# EAGLE design Hauptplatine (EAGLE 5.12)
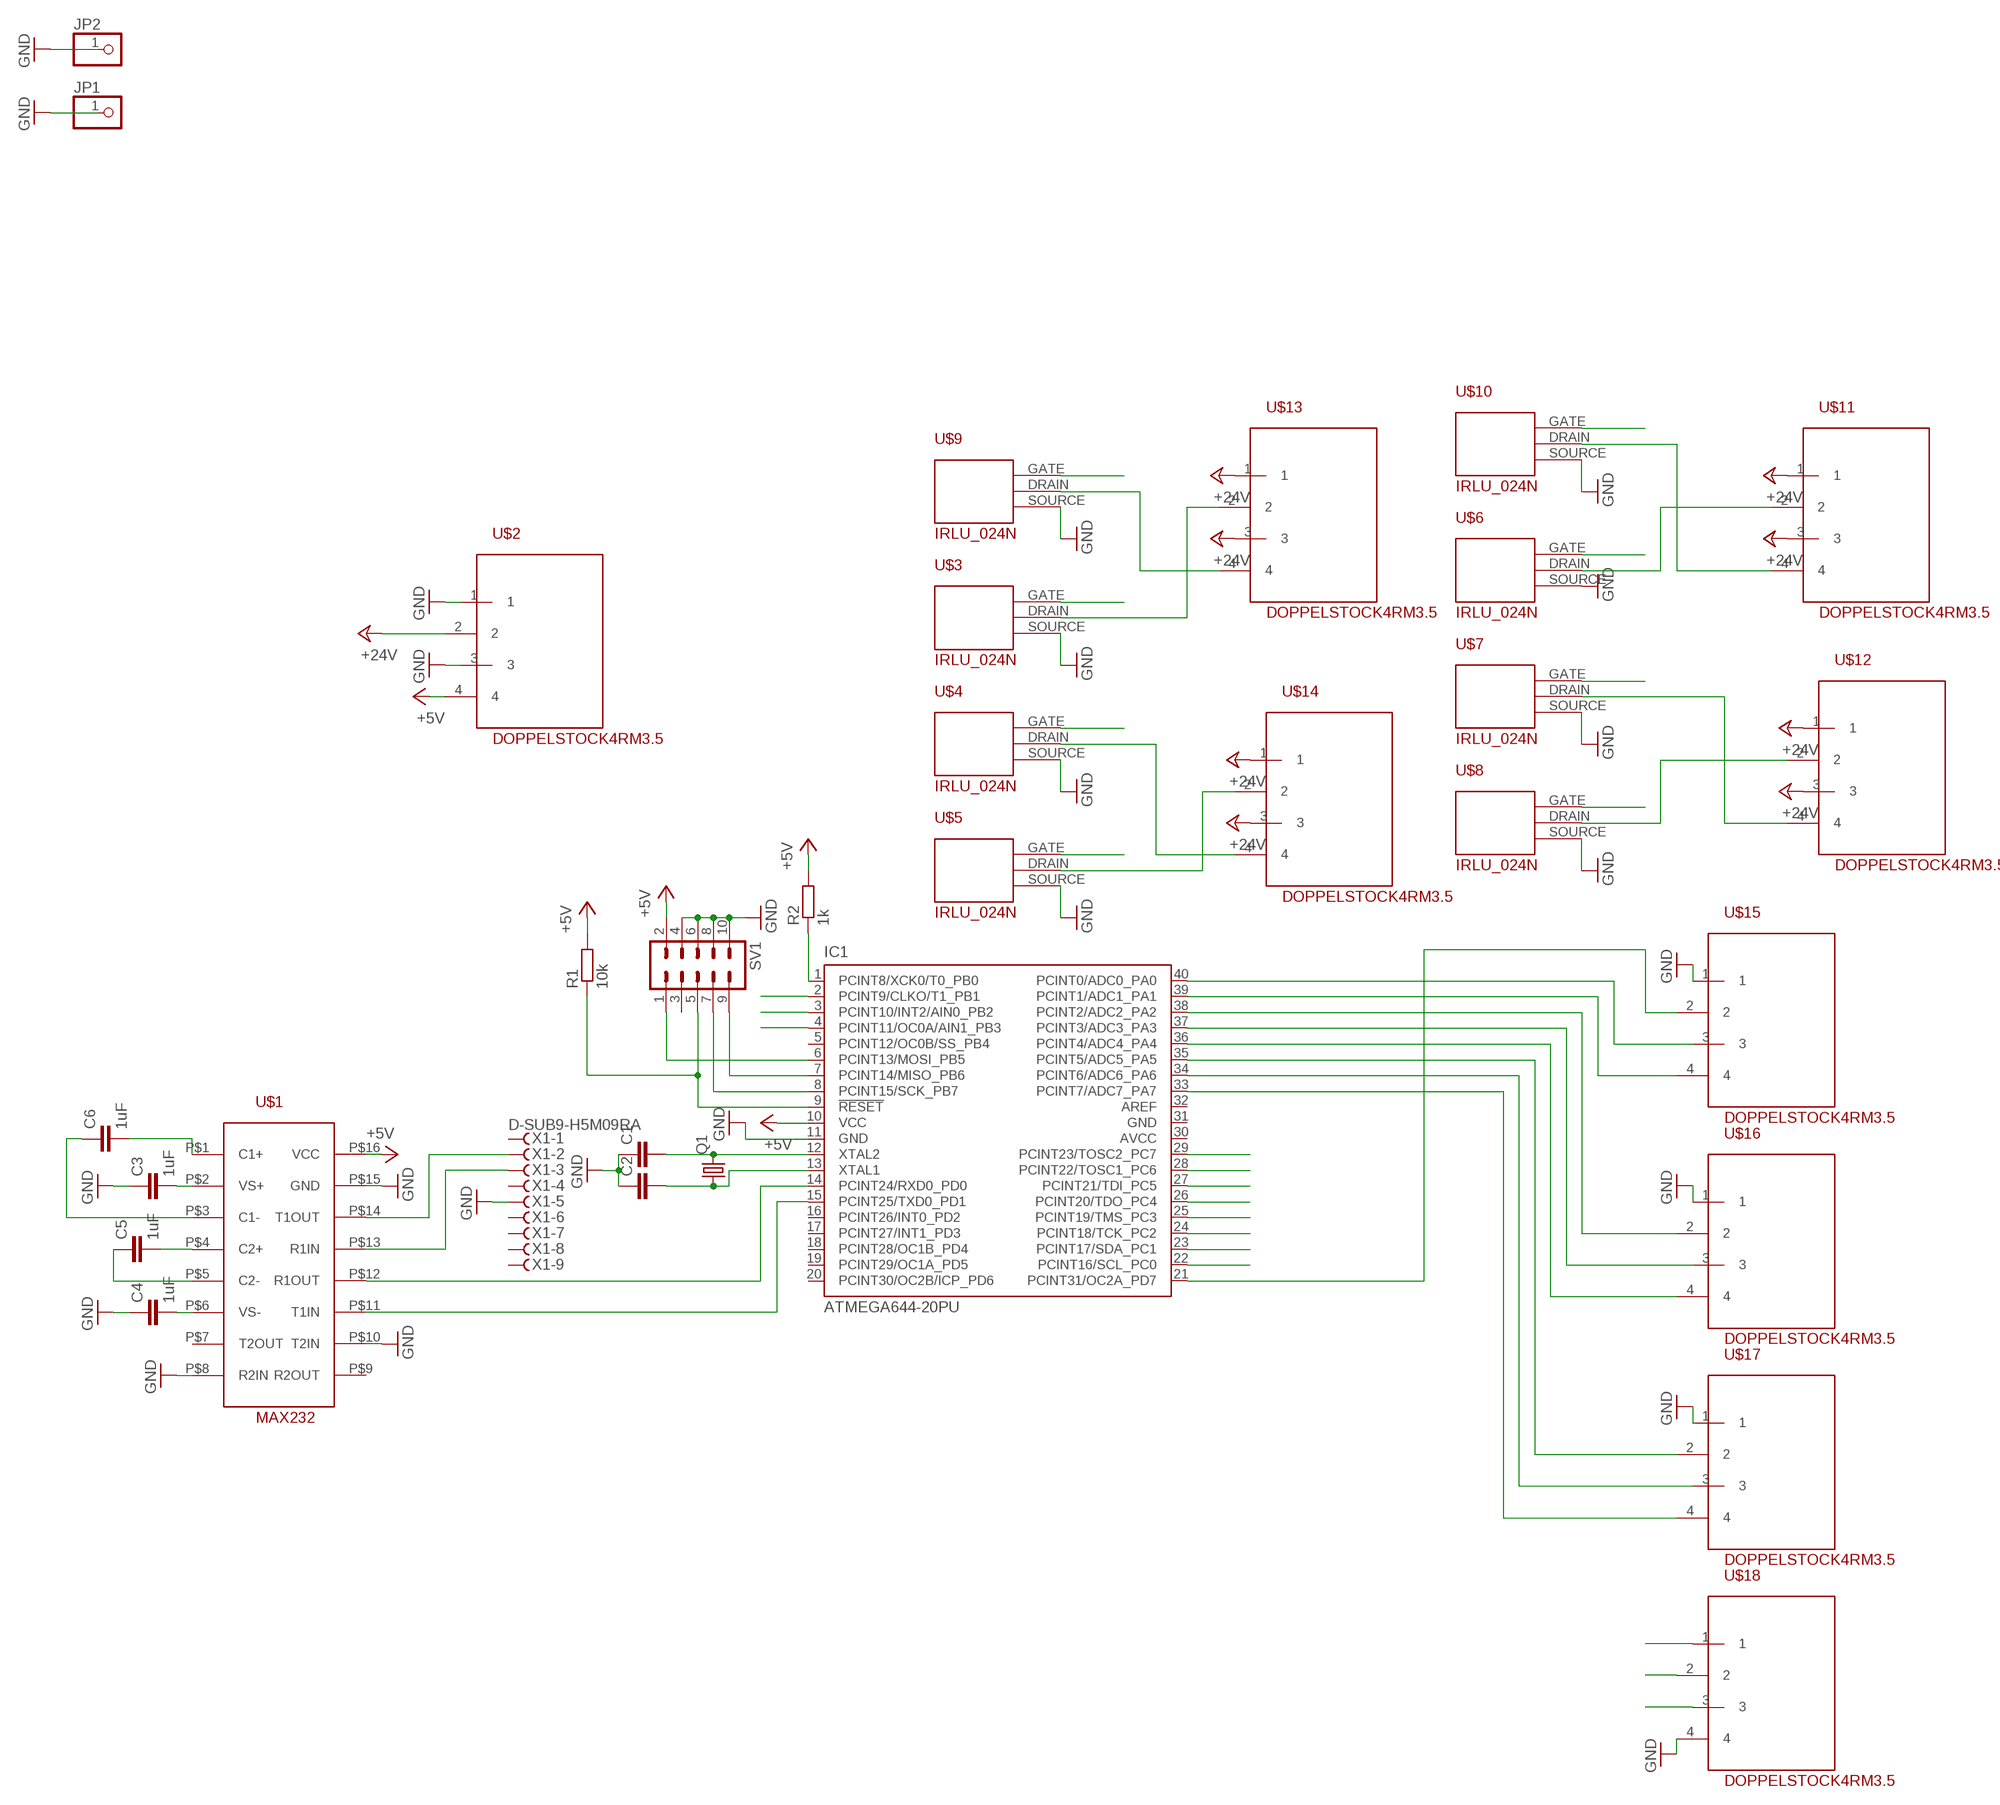
[diagram p0: schematic, sheet 1, part 1 of 2]
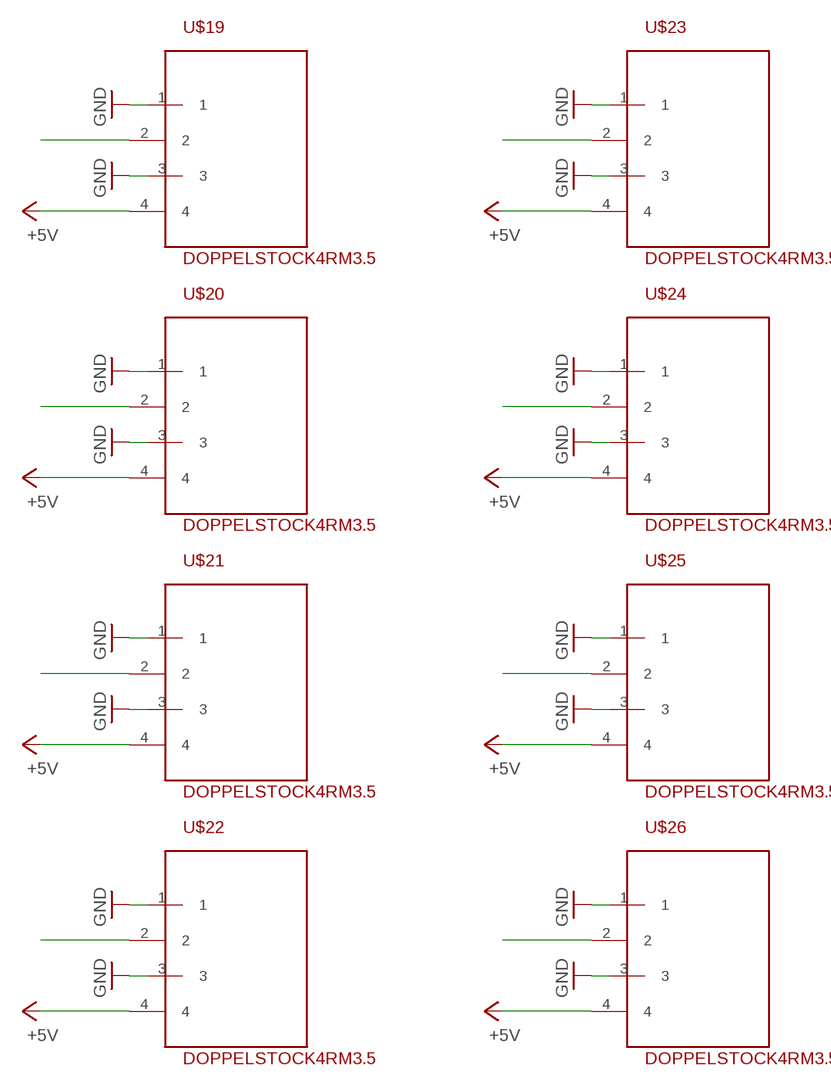
[diagram p1: schematic, sheet 1, part 2 of 2]

## Parts
C1  C-EUC0805  [C0805]
C2  C-EUC0805  [C0805]
C3  1uF  C-EUC1206  [C1206]
C4  1uF  C-EUC1206  [C1206]
C5  1uF  C-EUC1206  [C1206]
C6  1uF  C-EUC1206  [C1206]
IC1  ATMEGA644-20PU  [DIL40]
JP1  PINHD-1X1  [1X01]
JP2  PINHD-1X1  [1X01]
Q1  CRYSTALHC18U-V  [HC18U-V]
R1  10k  R-EU_R0805  [R0805]
R2  1k  R-EU_R1206  [R1206]
SV1  ML10  [ML10]
U$1  MAX232  [MAX232-DIL]
U$2  DOPPELSTOCK4RM3.5  [DOPPELSTOCK4RM3.5]
U$3  IRLU_024N  [IRLU_024N]
U$4  IRLU_024N  [IRLU_024N]
U$5  IRLU_024N  [IRLU_024N]
U$6  IRLU_024N  [IRLU_024N]
U$7  IRLU_024N  [IRLU_024N]
U$8  IRLU_024N  [IRLU_024N]
U$9  IRLU_024N  [IRLU_024N]
U$10  IRLU_024N  [IRLU_024N]
U$11  DOPPELSTOCK4RM3.5  [DOPPELSTOCK4RM3.5]
U$12  DOPPELSTOCK4RM3.5  [DOPPELSTOCK4RM3.5]
U$13  DOPPELSTOCK4RM3.5  [DOPPELSTOCK4RM3.5]
U$14  DOPPELSTOCK4RM3.5  [DOPPELSTOCK4RM3.5]
U$15  DOPPELSTOCK4RM3.5  [DOPPELSTOCK4RM3.5]
U$16  DOPPELSTOCK4RM3.5  [DOPPELSTOCK4RM3.5]
U$17  DOPPELSTOCK4RM3.5  [DOPPELSTOCK4RM3.5]
U$18  DOPPELSTOCK4RM3.5  [DOPPELSTOCK4RM3.5]
U$19  DOPPELSTOCK4RM3.5  [DOPPELSTOCK4RM3.5]
U$20  DOPPELSTOCK4RM3.5  [DOPPELSTOCK4RM3.5]
U$21  DOPPELSTOCK4RM3.5  [DOPPELSTOCK4RM3.5]
U$22  DOPPELSTOCK4RM3.5  [DOPPELSTOCK4RM3.5]
U$23  DOPPELSTOCK4RM3.5  [DOPPELSTOCK4RM3.5]
U$24  DOPPELSTOCK4RM3.5  [DOPPELSTOCK4RM3.5]
U$25  DOPPELSTOCK4RM3.5  [DOPPELSTOCK4RM3.5]
U$26  DOPPELSTOCK4RM3.5  [DOPPELSTOCK4RM3.5]
X1  D-SUB9-H5M09RA  [H5M09RA]

## Nets
+5V: IC1.10(VCC) R1.2 R2.2 SV1.2 U$1.P$16(VCC) U$2.4 U$19.4 U$20.4 U$21.4 U$22.4 U$23.4 U$24.4 U$25.4 U$26.4
+24V: U$2.2 U$11.1 U$11.3 U$12.1 U$12.3 U$13.1 U$13.3 U$14.1 U$14.3
GND: C1.1 C2.1 C3.1 C4.1 IC1.11(GND) JP1.1 JP2.1 SV1.4 SV1.6 SV1.8 SV1.10 U$1.P$8(R2IN) U$1.P$10(T2IN) U$1.P$15(GND) U$2.1 U$2.3 U$3.SOURCE U$4.SOURCE U$5.SOURCE U$6.SOURCE U$7.SOURCE U$8.SOURCE U$9.SOURCE U$10.SOURCE U$15.1 U$16.1 U$17.1 U$18.4 U$19.1 U$19.3 U$20.1 U$20.3 U$21.1 U$21.3 U$22.1 U$22.3 U$23.1 U$23.3 U$24.1 U$24.3 U$25.1 U$25.3 U$26.1 U$26.3 X1.5
N$1: C1.2 IC1.12(XTAL2) Q1.2
N$2: C2.2 IC1.13(XTAL1) Q1.1
N$3: C3.2 U$1.P$2(VS+)
N$4: C4.2 U$1.P$6(VS-)
N$5: C6.2 U$1.P$1(C1+)
N$6: C6.1 U$1.P$3(C1-)
N$7: C5.2 U$1.P$4(C2+)
N$8: C5.1 U$1.P$5(C2-)
N$9: IC1.15(PCINT25/TXD0_PD1) U$1.P$11(T1IN)
N$10: IC1.14(PCINT24/RXD0_PD0) U$1.P$12(R1OUT)
N$11: U$1.P$14(T1OUT) X1.2
N$12: U$1.P$13(R1IN) X1.3
N$13: IC1.6(PCINT13/MOSI_PB5) SV1.1
N$14: IC1.7(PCINT14/MISO_PB6) SV1.9
N$15: IC1.8(PCINT15/SCK_PB7) SV1.7
N$16: IC1.9(!RESET) R1.1 SV1.5
N$17: U$6.DRAIN U$11.2
N$18: U$8.DRAIN U$12.2
N$20: IC1.40(PCINT0/ADC0_PA0) U$15.3
N$21: IC1.39(PCINT1/ADC1_PA1) U$15.4
N$22: IC1.38(PCINT2/ADC2_PA2) U$16.2
N$23: IC1.37(PCINT3/ADC3_PA3) U$16.3
N$24: IC1.36(PCINT4/ADC4_PA4) U$16.4
N$25: IC1.35(PCINT5/ADC5_PA5) U$17.2
N$26: IC1.34(PCINT6/ADC6_PA6) U$17.3
N$27: IC1.33(PCINT7/ADC7_PA7) U$17.4
N$29: IC1.21(PCINT31/OC2A_PD7) U$15.2
ONEWIRE: IC1.1(PCINT8/XCK0/T0_PB0) R2.1 U$19.2 U$20.2 U$21.2 U$22.2 U$23.2 U$24.2 U$25.2 U$26.2
PB1: IC1.2(PCINT9/CLKO/T1_PB1) U$18.1
PB2: IC1.3(PCINT10/INT2/AIN0_PB2) U$18.2
PB3: IC1.4(PCINT11/OC0A/AIN1_PB3) U$18.3
S0: U$9.DRAIN U$13.4
S1: U$3.DRAIN U$13.2
S2: U$4.DRAIN U$14.4
S3: U$5.DRAIN U$14.2
S4: U$10.DRAIN U$11.4
S6: U$7.DRAIN U$12.4
SA0: IC1.22(PCINT16/SCL_PC0) U$9.GATE
SA1: IC1.23(PCINT17/SDA_PC1) U$3.GATE
SA2: IC1.24(PCINT18/TCK_PC2) U$4.GATE
SA3: IC1.25(PCINT19/TMS_PC3) U$5.GATE
SA4: IC1.26(PCINT20/TDO_PC4) U$10.GATE
SA5: IC1.27(PCINT21/TDI_PC5) U$6.GATE
SA6: IC1.28(PCINT22/TOSC1_PC6) U$7.GATE
SA7: IC1.29(PCINT23/TOSC2_PC7) U$8.GATE
Unconnected: IC1.5(PCINT12/OC0B/SS_PB4) IC1.16(PCINT26/INT0_PD2) IC1.17(PCINT27/INT1_PD3) IC1.18(PCINT28/OC1B_PD4) IC1.19(PCINT29/OC1A_PD5) IC1.20(PCINT30/OC2B/ICP_PD6) IC1.32(AREF) SV1.3 U$1.P$7(T2OUT) U$1.P$9(R2OUT) X1.1 X1.4 X1.6 X1.7 X1.8 X1.9

## Power pins joined to a net without a drawn wire
AVCC: IC1.30(AVCC)
GND: IC1.31(GND)

## Library data of the parts
C1-C6 = rcl:C-EU: CAPACITOR, European symbol
IC1 = atmel:ATMEGA644-*PU: 8-bit Microcontroller with 64K Bytes In-System Programmable Flash Auto generated by make-symbol-device-package-bsdl.ulp Rev. 34 Source: http://www.atmel.com/dyn/resources/prod_documents/doc2593.pdf; MPN: ATMEGA644-20PU; OC_FARNELL: 1288340; OC_NEWARK: 23M5060
JP1 JP2 = pinhead:PINHD-1X1: PIN HEADER
Q1 = crystal:CRYSTAL: CRYSTAL; OC_FARNELL: unknown; OC_NEWARK: unknown
R1 R2 = rcl:R-EU_: RESISTOR, European symbol
SV1 = con-harting-ml:ML10: HARTING; OC_FARNELL: unknown; OC_NEWARK: unknown
U$1 = max232:MAX232
U$2 U$11-U$26 = anschlussklemmen:DOPPELSTOCK4
U$3-U$10 = irlu024n:IRLU_024N
X1 = con-thomas-betts:D-SUB9-: D-Subminiatur Connector Source: Electronioc Interconnects European Edition 1998; OC_FARNELL: unknown; OC_NEWARK: unknown

## Board
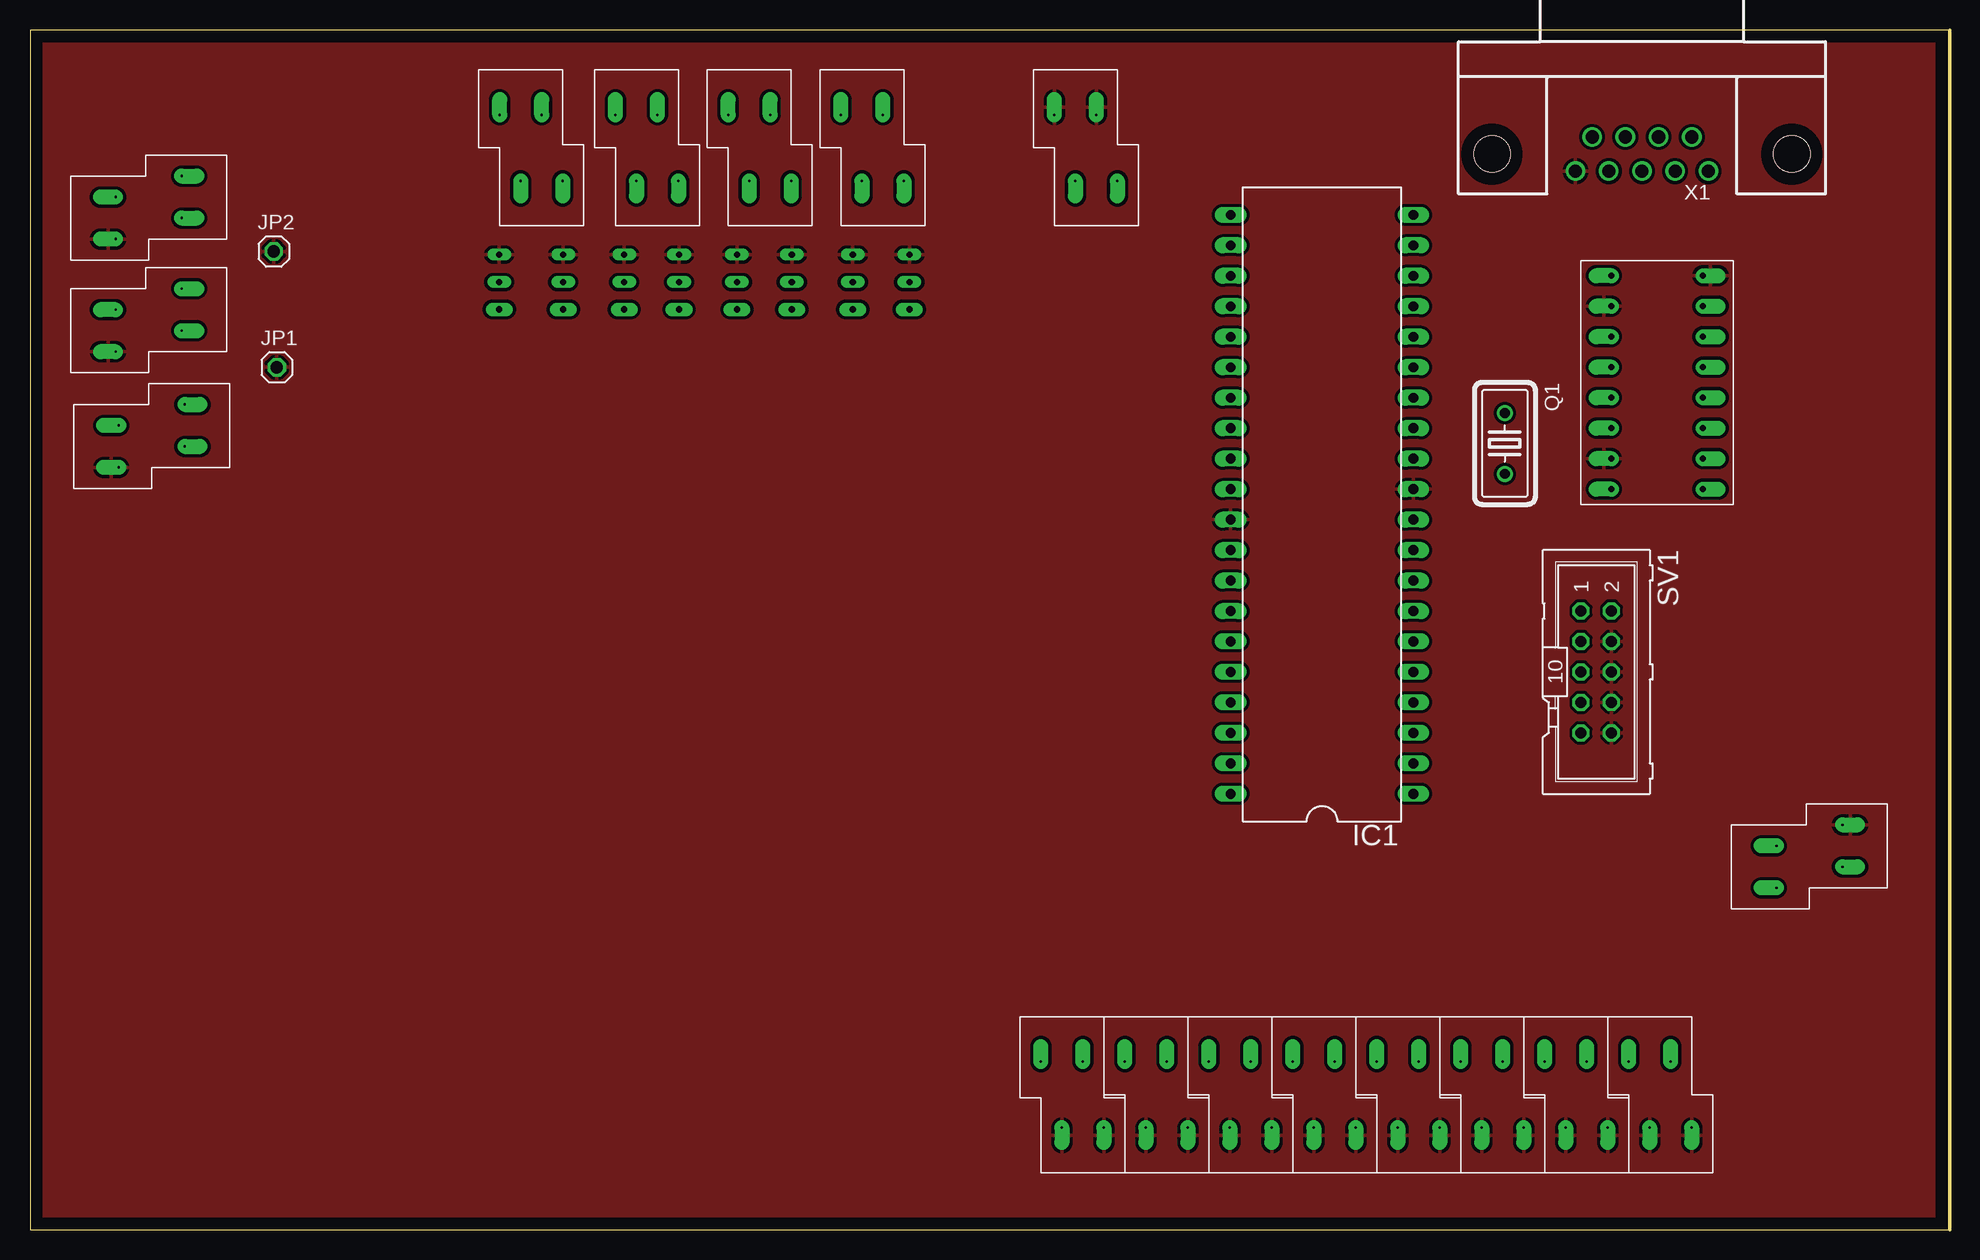
[diagram p2: board, top side]
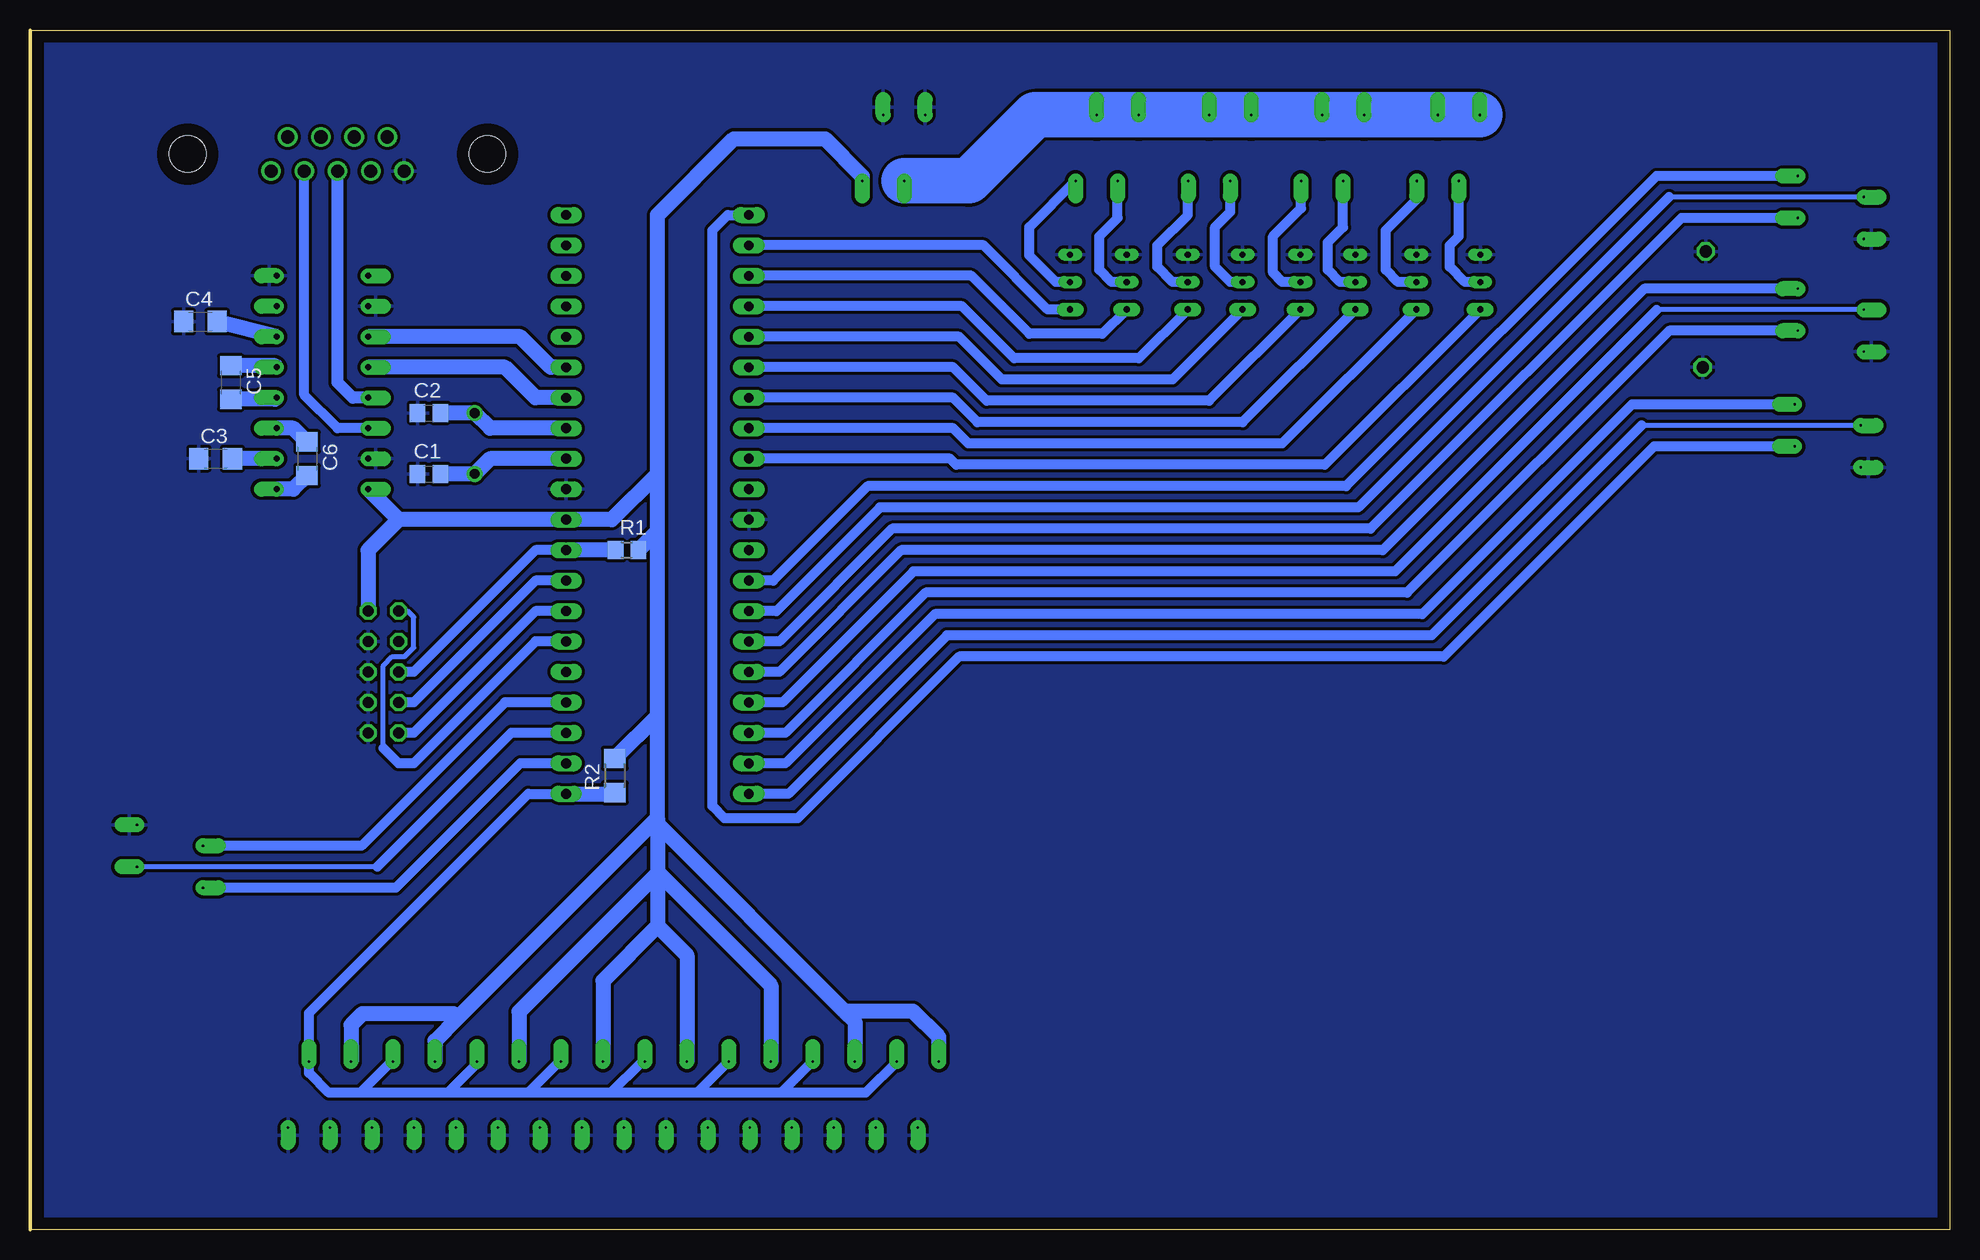
[diagram p3: board, bottom side, seen from below]

Size 160 x 100 mm. Coordinates in mm from the lower left corner, seen from the top.
Outline: 0,0 160,0 160,100 0,100 0,0
Copper layers (1*16): Top 0.035mm / dielectric 1.5mm / Bottom 0.035mm
Design rules "default *": minimum track width 10mil, minimum drill 1mil, track to track 10mil, track to pad 12mil, pad to pad 12mil, via to via 12mil, smd to smd 12mil, copper to edge 40mil, drill to drill 8mil, minimum pad ring 10mil, minimum via ring 8mil, stop-mask expansion 4mil, vias tented up to drill 0mil, thermal gap 10mil

### Footprints (pad centres in the part's own frame; a part is rotated, then mirrored left to right if it is on the bottom)
C0805 = smd 1.3 x 1.5: 1 -0.95,0; 2 0.95,0
C1206 = smd 1.6 x 1.8: 1 -1.4,0; 2 1.4,0
DIL40 = drill 0.813 long: 1 -24.13,-7.62; 2 -21.59,-7.62; 3 -19.05,-7.62; 4 -16.51,-7.62; 5 -13.97,-7.62; 6 -11.43,-7.62; 7 -8.89,-7.62; 8 -6.35,-7.62; 9 -3.81,-7.62; 10 -1.27,-7.62; 11 1.27,-7.62; 12 3.81,-7.62; 13 6.35,-7.62; 14 8.89,-7.62; 15 11.43,-7.62; 16 13.97,-7.62; 17 16.51,-7.62; 18 19.05,-7.62; 19 21.59,-7.62; 20 24.13,-7.62; 21 24.13,7.62; 22 21.59,7.62; 23 19.05,7.62; 24 16.51,7.62; 25 13.97,7.62; 26 11.43,7.62; 27 8.89,7.62; 28 6.35,7.62; 29 3.81,7.62; 30 1.27,7.62; 31 -1.27,7.62; 32 -3.81,7.62; 33 -6.35,7.62; 34 -8.89,7.62; 35 -11.43,7.62; 36 -13.97,7.62; 37 -16.51,7.62; 38 -19.05,7.62; 39 -21.59,7.62; 40 -24.13,7.62
1X01 = drill 1.016 octagon: 1 0,0
HC18U-V = drill 0.813 round: 1 -2.54,0; 2 2.54,0
R0805 = smd 1.3 x 1.5: 1 -0.95,0; 2 0.95,0
R1206 = smd 1.6 x 1.803: 1 -1.422,0; 2 1.422,0
ML10 = drill 0.914 octagon: 1 -5.08,-1.27; 2 -5.08,1.27; 3 -2.54,-1.27; 4 -2.54,1.27; 5 0,-1.27; 6 0,1.27; 7 2.54,-1.27; 8 2.54,1.27; 9 5.08,-1.27; 10 5.08,1.27
MAX232-DIL = drill 0.5 pad 1.27 offset: P$1 -5.08,7.62; P$2 -5.08,5.08; P$3 -5.08,2.54; P$4 -5.08,0; P$5 -5.08,-2.54; P$6 -5.08,-5.08; P$7 -5.08,-7.62; P$8 -5.08,-10.16; P$9 2.54,-10.16; P$10 2.54,-7.62; P$11 2.54,-5.08; P$12 2.54,-2.54; P$13 2.54,0; P$14 2.54,2.54; P$15 2.54,5.08; P$16 2.54,7.62
DOPPELSTOCK4RM3.5 = drill 0.2 pad 1.27 offset: 1 2,2; 2 -3.5,0.25; 3 2,-1.5; 4 -3.5,-3.25
IRLU_024N = drill 0.508 pad 1.016 long: DRAIN 0,0; SOURCE 0,-2.286 | drill 0.508 pad 1.143 long: GATE 0,2.286
H5M09RA = drill 1.092 round: 1 -5.537,1.422; 2 -2.769,1.422; 3 0,1.422; 4 2.769,1.422; 5 5.537,1.422; 6 -4.153,-1.422; 7 -1.384,-1.422; 8 1.384,-1.422; 9 4.153,-1.422 | hole 3.048: -12.497,0; 12.497,0

### Placement (x,y rotation side)
C1  126.75,62.99 0 bottom
C2  126.75,68.07 0 bottom
C3  144.53,64.26 0 bottom
C4  145.8,75.69 0 bottom
C5  143.26,70.61 270 bottom
C6  136.91,64.26 270 bottom
IC1  107.7,60.45 90 top
JP1  20.57,71.88 0 top
JP2  20.32,81.53 0 top
Q1  122.94,65.53 270 top
R1  110.24,56.64 0 bottom
R2  111.25,37.85 90 bottom
SV1  130.56,46.48 270 top
U$1  134.37,69.34 180 top
U$2  87.38,90.93 90 top
U$3  68.58,78.99 180 top
U$4  63.5,78.99 180 top
U$5  58.93,78.99 180 top
U$6  49.53,78.99 180 top
U$7  44.45,78.99 180 top
U$8  39.12,78.99 180 top
U$9  73.3,78.99 180 top
U$10  54.1,78.99 180 top
U$11  50.8,90.93 90 top
U$12  41.15,90.93 90 top
U$13  69.6,90.93 90 top
U$14  60.2,90.93 90 top
U$15  9.4,65.53 180 top
U$16  9.14,75.18 180 top
U$17  9.14,84.58 180 top
U$18  147.57,30.48 180 top
U$19  136.5,10.5 270 top
U$20  129.5,10.5 270 top
U$21  122.5,10.5 270 top
U$22  115.5,10.5 270 top
U$23  108.5,10.5 270 top
U$24  101.5,10.5 270 top
U$25  94.5,10.5 270 top
U$26  87.5,10.5 270 top
X1  134.37,89.66 180 top

### Tracks (layer width: path | path; a pad name or v marks a point on that pad's centre or on a via)
+5V
  Bottom 1.27: 129.29,59.18 IC1.10 111.51,59.18 107.7,62.99 | 129.29,59.18 U$1.P$16 | U$2.4 90.63,87.83 93.73,90.93 101.35,90.93 107.7,84.58 107.7,62.99 | 107.7,58.23 R1.2 | 107.7,58.23 107.7,62.99 | SV1.2 131.83,56.64 129.29,59.18 | 107.7,42.82 107.7,58.23 | 107.7,42.82 R2.2 | U$22.4 112.25,20.75 107.7,25.3 | 107.7,29.7 107.7,25.3 | 107.7,29.8 107.7,29.7 | 107.7,34.3 107.7,29.8 | 107.7,34.3 107.7,42.82 | U$21.4 119.25,18.15 107.7,29.7 | U$20.4 126.25,15.75 124.35,17.65 | 107.95,34.05 107.7,34.3 | 107.95,34.05 124.35,17.65 | U$23.4 105.25,22.86 107.7,25.3 | U$24.4 98.25,20.35 107.7,29.8 | U$25.4 91.25,17.35 92.1,18.2 | 92.1,18.2 107.95,34.05 | U$26.4 84.25,16.05 86.4,18.2 92.1,18.2 | U$19.4 133.25,17.05 132.3,18 124.7,18 124.35,17.65
+24V
  Bottom 3.81: U$2.2 81.73,87.43 76.23,92.93 U$13.3 U$13.1 U$14.3 U$14.1 U$11.3 U$11.1 U$12.3 U$12.1
GND
  pour Bottom: 0,0 160.02,0 160.02,100.33 0,100.33
  pour Top: 0,0 160.02,0 160.02,100.08 0,100.08
N$1
  Bottom 1.27: IC1.12 121.67,64.26 Q1.2 C1.2
N$2
  Bottom 1.27: IC1.13 121.67,66.8 Q1.1 C2.2
N$3
  Bottom 1.27: U$1.P$2 C3.2
N$4
  Bottom 1.27: U$1.P$6 C4.2
N$5
  Bottom 1.27: C6.2 138.05,61.72 U$1.P$1
N$6
  Bottom 1.27: C6.1 138.05,66.8 U$1.P$3
N$7
  Bottom 1.27: U$1.P$4 139.58,69.21 C5.2
N$8
  Bottom 1.27: U$1.P$5 139.58,72.01 C5.1
N$9
  Bottom 1.27: IC1.15 116.59,71.88 119.13,74.42 U$1.P$11
N$10
  Bottom 1.27: IC1.14 117.86,69.34 120.4,71.88 U$1.P$12
N$11
  Bottom 0.813: U$1.P$14 134.37,66.8 137.13,69.57 X1.2
N$12
  Bottom 1.016: U$1.P$13 133.1,69.34 134.37,70.61 X1.3
N$13
  Bottom 0.406: SV1.1 128.52,51.56 128.02,51.05 128.02,48.51 128.78,47.75 129.79,47.75 130.56,46.99 130.56,40.13
  Bottom 0.813: 130.56,40.13 129.29,38.86 128.02,38.86 117.86,49.02 IC1.6
N$14
  Bottom 0.813: SV1.9 128.02,41.4 117.86,51.56 IC1.7
N$15
  Bottom 0.813: SV1.7 128.02,43.94 117.86,54.1 IC1.8
N$16
  Bottom 0.813: SV1.5 128.02,46.48 117.86,56.64 IC1.9
  Bottom 1.27: R1.1 IC1.9
N$17
  Bottom 0.813: U$6.DRAIN 50.8,78.99 51.82,80.01 51.82,82.3 50.55,83.56 U$11.2
N$18
  Bottom 0.813: U$8.DRAIN 40.39,78.99 41.66,80.26 41.66,82.04 40.9,82.8 U$12.2
N$20
  Bottom 0.406: U$15.3 25.68,67.03
  Bottom 0.813: IC1.40 96.77,36.32 83.57,49.53 43.18,49.53 25.68,67.03
N$21
  Bottom 0.813: IC1.39 97.03,38.86 84.58,51.31 43.94,51.31 26.47,68.78 U$15.4
N$22
  Bottom 0.813: IC1.38 97.03,41.4 85.34,53.09 45.21,53.09 23.36,74.93 U$16.2
N$23
  Bottom 0.406: U$16.3 24.41,76.68
  Bottom 0.813: IC1.37 97.28,43.94 86.36,54.86 46.23,54.86 24.41,76.68
N$24
  Bottom 0.813: IC1.36 97.54,46.48 87.38,56.64 47.24,56.64 25.45,78.43 U$16.4
N$25
  Bottom 0.813: IC1.35 97.54,49.02 88.14,58.42 48.26,58.42 22.35,84.33 U$17.2
N$26
  Bottom 0.406: U$17.3 23.39,86.08
  Bottom 0.813: IC1.34 97.79,51.56 89.15,60.2 49.28,60.2 23.39,86.08
N$27
  Bottom 0.813: IC1.33 98.04,54.1 90.17,61.98 50.29,61.98 24.44,87.83 U$17.4
N$29
  Bottom 0.813: IC1.21 101.85,84.58 103.12,83.31 103.12,35.31 102.11,34.29 96.01,34.29 82.55,47.75 42.16,47.75 24.63,65.28 U$15.2
ONEWIRE
  Bottom 0.813: IC1.1 118.48,36.32 136.75,18.05 U$19.2 136.75,13.05 135.1,11.4 132.5,11.4 | 97.4,11.4 90.35,11.4 U$26.2 | 97.4,11.4 104.4,11.4 | 104.4,11.4 111.6,11.4 | 111.6,11.4 118.5,11.4 | 118.5,11.4 125.2,11.4 | 125.2,11.4 132.5,11.4 | U$25.2 94.8,14 97.4,11.4 | U$24.2 101.8,14 104.4,11.4 | U$23.2 109,14 111.6,11.4 | U$22.2 115.9,14 118.5,11.4 | U$21.2 122.75,13.85 125.2,11.4 | U$20.2 129.9,14 132.5,11.4
  Bottom 1.27: IC1.1 111.35,36.32 R2.1
PB1
  Bottom 0.813: IC1.2 119.13,38.86 129.51,28.48 U$18.1
PB2
  Bottom 0.406: 131.06,30.23 U$18.2
  Bottom 0.813: IC1.3 119.89,41.4 131.06,30.23
PB3
  Bottom 0.813: IC1.4 120.4,43.94 132.36,31.98 U$18.3
S0
  Bottom 0.813: U$9.DRAIN 74.49,78.99 76.7,81.2 76.7,83.58 U$13.4
S1
  Bottom 0.813: U$3.DRAIN 69.85,78.99 70.87,80.01 70.87,82.8 69.35,84.32 U$13.2
S2
  Bottom 0.813: U$4.DRAIN 64.77,78.99 66.04,80.26 66.04,82.04 63.5,84.58 63.5,87.38 U$14.4
S3
  Bottom 0.813: U$5.DRAIN 59.94,78.99 61.21,80.26 61.21,83.57 59.94,84.84 U$14.2
S4
  Bottom 0.813: U$10.DRAIN 55.63,78.99 56.39,79.76 56.39,82.8 54.05,85.14 U$11.4
S6
  Bottom 0.813: U$7.DRAIN 45.97,78.99 46.99,80.01 46.99,83.31 44.4,85.9 U$12.4
SA0
  Bottom 0.813: IC1.22 80.52,82.04 75.18,76.71 U$9.GATE
SA1
  Bottom 0.813: IC1.23 81.53,79.5 76.71,74.68 70.61,74.68 U$3.GATE
SA2
  Bottom 0.813: IC1.24 82.3,76.96 77.98,72.64 67.56,72.64 U$4.GATE
SA3
  Bottom 0.813: IC1.25 82.55,74.42 78.99,70.87 64.77,70.87 U$5.GATE
SA4
  Bottom 0.813: IC1.26 83.06,71.88 80.26,69.09 61.72,69.09 U$10.GATE
SA5
  Bottom 0.813: IC1.27 83.06,69.34 81.03,67.31 58.93,67.31 U$6.GATE
SA6
  Bottom 0.813: IC1.28 83.06,66.8 81.79,65.53 55.63,65.53 U$7.GATE
SA7
  Bottom 0.813: IC1.29 83.31,64.26 82.8,63.75 52.07,63.75 U$8.GATE